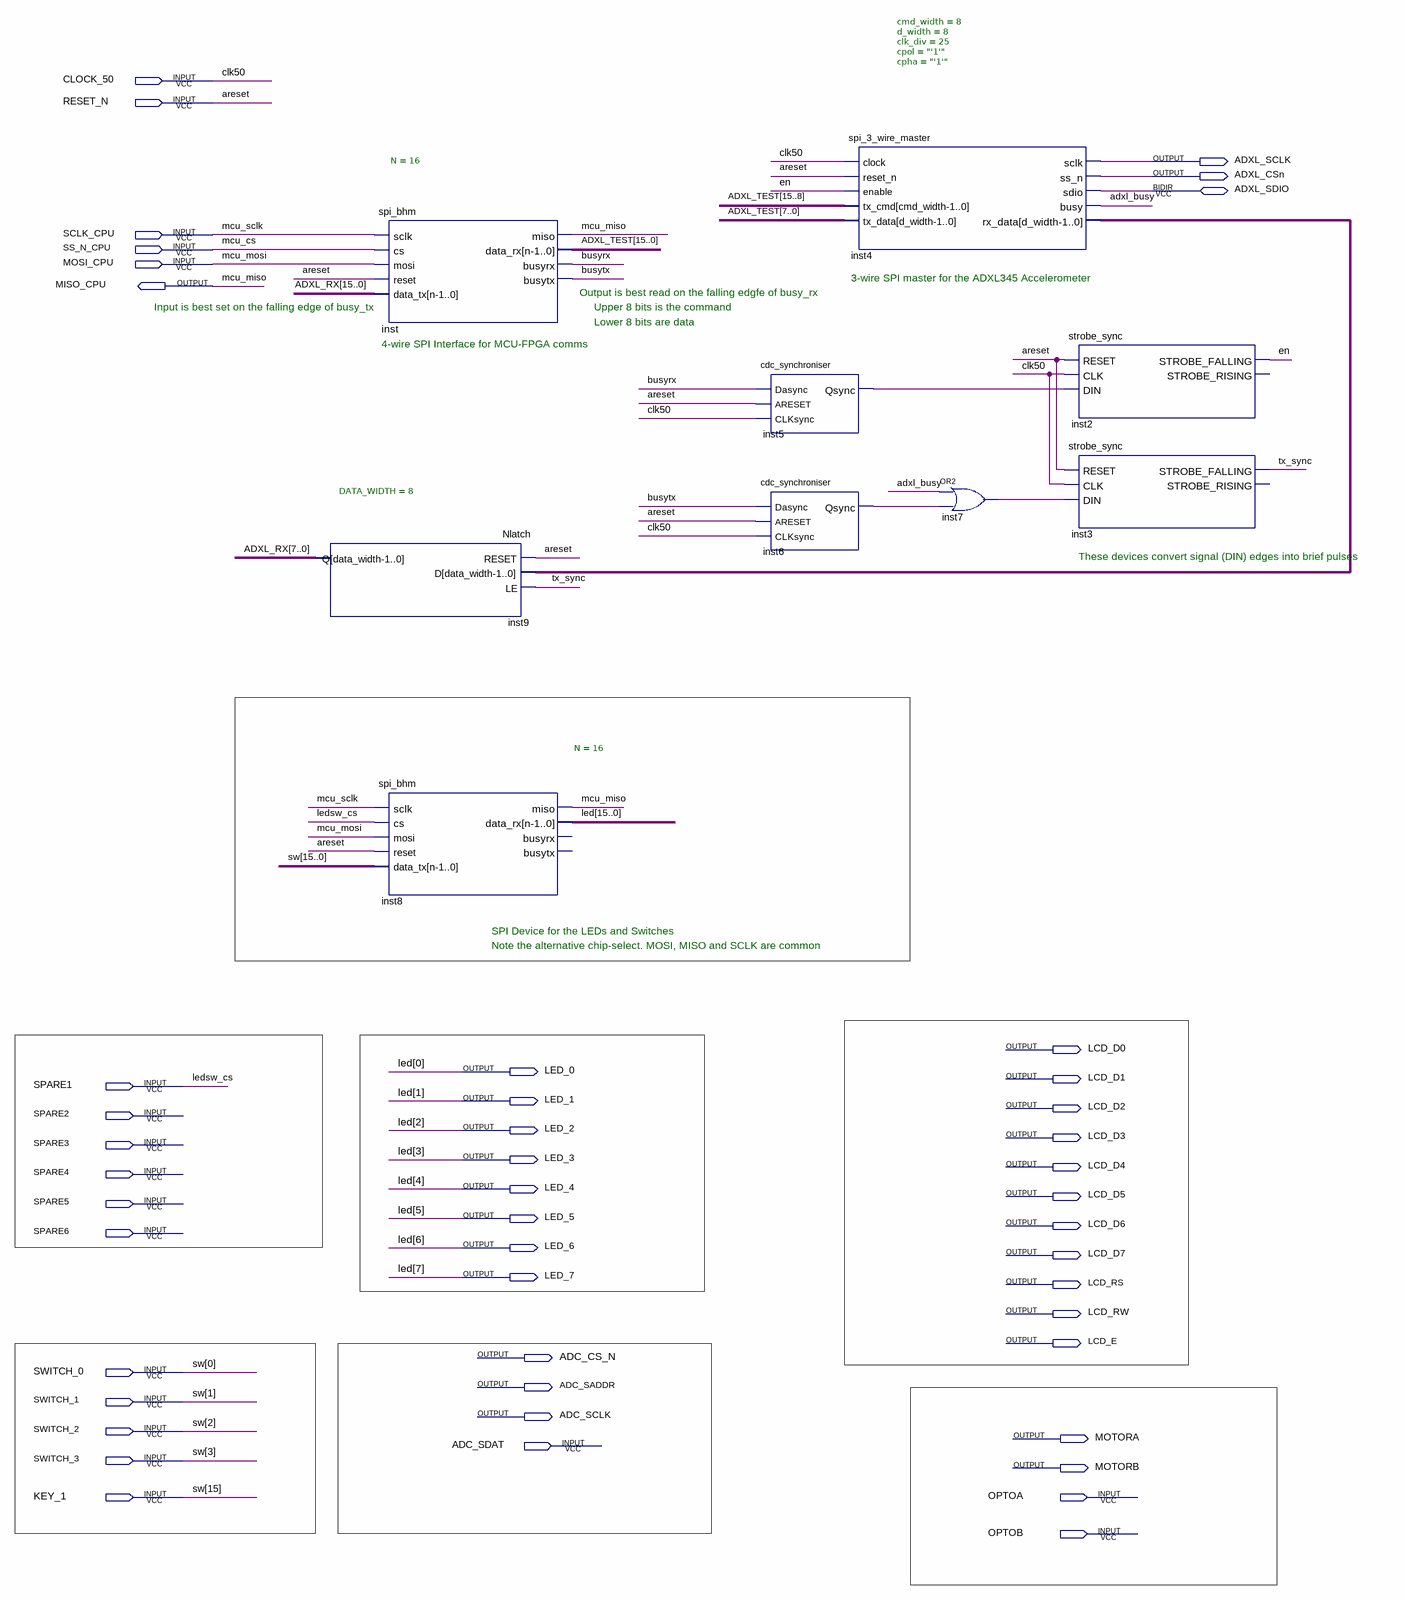
[diagram p0: schematic sheet]
// Quartus schematic AXDL345_Example.bdf as structural Verilog: 9 symbols, 47 pins
module AXDL345_Example (
  input  CLOCK_50,
  input  RESET_N,
  input  SCLK_CPU,
  input  SS_N_CPU,
  input  MOSI_CPU,
  input  SPARE1,
  input  SPARE2,
  input  SPARE3,
  input  SPARE4,
  input  SPARE5,
  input  SPARE6,
  input  SWITCH_0,
  input  SWITCH_1,
  input  SWITCH_2,
  input  ADC_SDAT,
  input  SWITCH_3,
  input  KEY_1,
  input  OPTOA,
  input  OPTOB,
  inout  ADXL_SDIO,
  output ADXL_SCLK,
  output ADXL_CSn,
  output MISO_CPU,
  output LCD_D0,
  output LED_0,
  output LCD_D1,
  output LED_1,
  output LCD_D2,
  output LED_2,
  output LCD_D3,
  output LED_3,
  output LCD_D4,
  output LED_4,
  output LCD_D5,
  output LED_5,
  output LCD_D6,
  output LED_6,
  output LCD_D7,
  output LED_7,
  output LCD_RS,
  output LCD_RW,
  output LCD_E,
  output ADC_CS_N,
  output ADC_SADDR,
  output ADC_SCLK,
  output MOTORA,
  output MOTORB
);

  wire adxl_busy, busyrx, busytx, en, inst5_qsync, inst6_qsync, inst7_out, tx_sync;
  wire [7:0] inst4_rx_data;
  wire [14:4] sw;
  wire [15:0] ADXL_RX, ADXL_TEST;
  wire [15:8] led;

  Nlatch #(.DATA_WIDTH(8)) inst9 (.RESET(RESET_N), .D(inst4_rx_data), .LE(tx_sync), .Q(ADXL_RX[7:0]));
  spi_bhm #(.N(16)) inst (
    .sclk(SCLK_CPU), .cs(SS_N_CPU), .mosi(MOSI_CPU), .reset(RESET_N), .data_tx(ADXL_RX), .miso(MISO_CPU),
    .data_rx(ADXL_TEST), .busyrx(busyrx), .busytx(busytx));
  spi_bhm #(.N(16)) inst8 (
    .sclk(SCLK_CPU), .cs(SPARE1), .mosi(MOSI_CPU), .reset(RESET_N),
    .data_tx({KEY_1, sw, SWITCH_3, SWITCH_2, SWITCH_1, SWITCH_0}), .miso(MISO_CPU),
    .data_rx({led, LED_7, LED_6, LED_5, LED_4, LED_3, LED_2, LED_1, LED_0}));  // open: busyrx, busytx
  cdc_synchroniser inst5 (.Dasync(busyrx), .ARESET(RESET_N), .CLKsync(CLOCK_50), .Qsync(inst5_qsync));
  cdc_synchroniser inst6 (.Dasync(busytx), .ARESET(RESET_N), .CLKsync(CLOCK_50), .Qsync(inst6_qsync));
  spi_3_wire_master #(.cmd_width(8), .d_width(8), .clk_div(25), .cpol("'1'"), .cpha("'1'")) inst4 (
    .clock(CLOCK_50), .reset_n(RESET_N), .enable(en), .tx_cmd(ADXL_TEST[15:8]), .tx_data(ADXL_TEST[7:0]),
    .sclk(ADXL_SCLK), .ss_n(ADXL_CSn), .busy(adxl_busy), .rx_data(inst4_rx_data), .sdio(ADXL_SDIO));
  or inst7 (inst7_out, adxl_busy, inst6_qsync);
  strobe_sync inst2 (.RESET(RESET_N), .CLK(CLOCK_50), .DIN(inst5_qsync), .STROBE_FALLING(en));  // open: STROBE_RISING
  strobe_sync inst3 (
    .RESET(RESET_N), .CLK(CLOCK_50), .DIN(inst7_out), .STROBE_FALLING(tx_sync));  // open: STROBE_RISING

  // Other names for the same wires on the sheet: areset = RESET_N; clk50 = CLOCK_50;
  //   led[7:0] = {LED_7, LED_6, LED_5, LED_4, LED_3, LED_2, LED_1, LED_0}; ledsw_cs = SPARE1; mcu_cs = SS_N_CPU;
  //   mcu_miso = MISO_CPU; mcu_mosi = MOSI_CPU; mcu_sclk = SCLK_CPU;
  //   sw (some bits) = {KEY_1, SWITCH_3, SWITCH_2, SWITCH_1, SWITCH_0}

  // Notes on the sheet:
  //   3-wire SPI master for the ADXL345 Accelerometer
  //   Output is best read on the falling edgfe of busy_rx
  //   Input is best set on the falling edge of busy_tx
  //   Upper 8 bits is the command
  //   Lower 8 bits are data
  //   4-wire SPI Interface for MCU-FPGA comms
  //   These devices convert signal (DIN) edges into brief pulses
  //   SPI Device for the LEDs and Switches
  //   Note the alternative chip-select. MOSI, MISO and SCLK are common
endmodule
